# EAGLE schematic SENSOR_TESTER_EAGLE_SCHEMATIC (EAGLE 9.4.2)
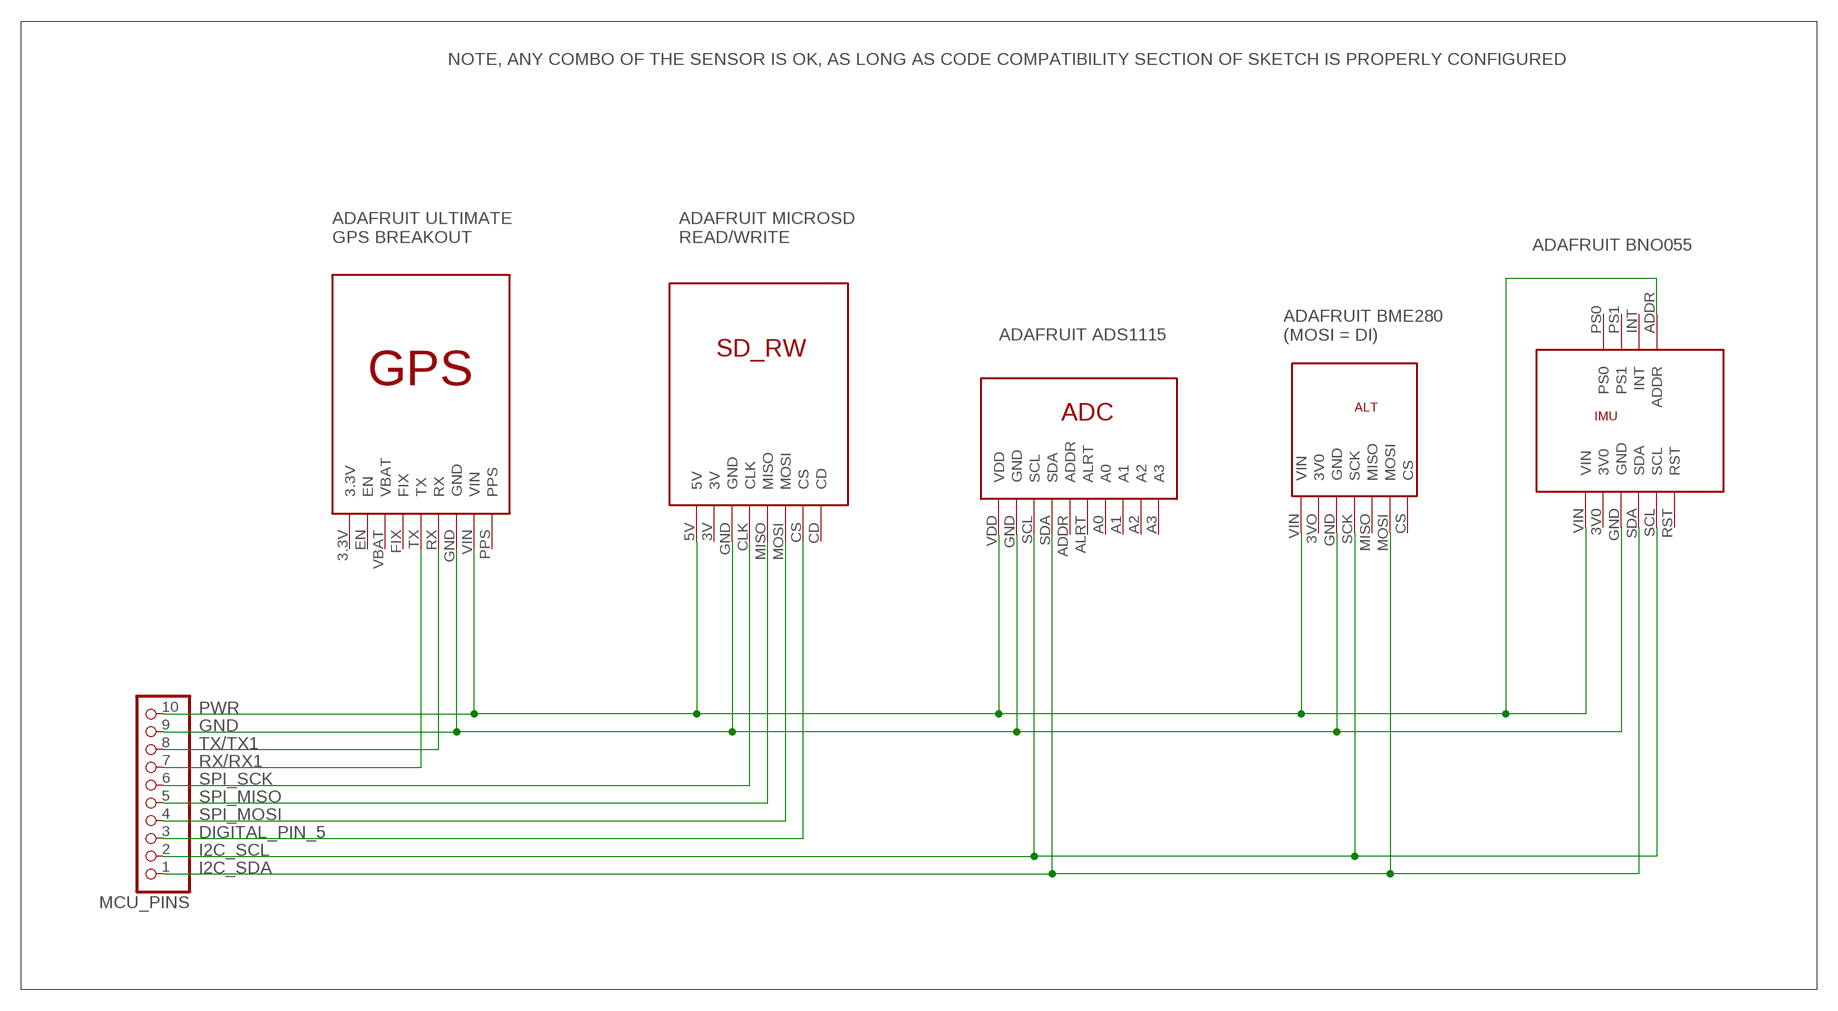
[diagram p0: schematic, sheet 1]

## Parts
MCU_PINS  PINHD-1X10/90  [1X10/90]
U$1  ADAFRUIT_GPS  [ADAFRUIT_GPS]
U$2  ADAFRUI_SD_RW  [ADAFRUIT_SD_RW]
U$3  ADS1115  [ADS1115]
U$4  BME280  [BME280]
U$5  BNO055  [BNO055]

## Nets
DIGITAL_PIN_5: MCU_PINS.3 U$2.CS
GND: MCU_PINS.9 U$1.GND U$2.GND U$3.GND U$4.GND U$5.GND
I2C_SCL: MCU_PINS.2 U$3.SCL U$4.SCK U$5.SCL
I2C_SDA: MCU_PINS.1 U$3.SDA U$4.MOSI U$5.SDA
PWR: MCU_PINS.10 U$1.VIN U$2.5V U$3.VDD U$4.VIN U$5.ADDR U$5.VIN
RX/RX1: MCU_PINS.7 U$1.TX
SPI_MISO: MCU_PINS.5 U$2.MISO
SPI_MOSI: MCU_PINS.4 U$2.MOSI
SPI_SCK: MCU_PINS.6 U$2.CLK
TX/TX1: MCU_PINS.8 U$1.RX
Unconnected: U$1.3.3V U$1.EN U$1.FIX U$1.PPS U$1.VBAT U$2.3V U$2.CD U$3.A0 U$3.A1 U$3.A2 U$3.A3 U$3.ADDR U$3.ALRT U$4.3VO(3V0) U$4.CS U$4.MISO U$5.3V0 U$5.INT U$5.PS0 U$5.PS1 U$5.RST

## Notes on the sheet
- NOTE, ANY COMBO OF THE SENSOR IS OK, AS LONG AS CODE COMPATIBILITY SECTION OF SKETCH IS PROPERLY CONFIGURED
- ADAFRUIT ULTIMATE 
  GPS BREAKOUT
- ADAFRUIT MICROSD
  READ/WRITE
- ADAFRUIT BNO055
- ADAFRUIT ADS1115
- ADAFRUIT BME280
  (MOSI = DI)

## Library data of the parts
MCU_PINS = pinhead:PINHD-1X10: PIN HEADER
U$1 = Adafruit_Arduino:ADAFRUIT_GPS
U$2 = Adafruit_Arduino:ADAFRUI_SD_RW
U$3 = Adafruit_Arduino:ADS1115
U$4 = Adafruit_Arduino:BME280
U$5 = Adafruit_Arduino:BNO055